# Altium schematic sheet Power1.schdoc
size 420 x 298 mm; Symbol: Sheet-Symbol_A4; Company: 嘉立创EDA; Version: V1.0; Page Size: A4; @Project Name: prj_extend_and_core_board_7_8; @Page Count: 7; @Update Date: 2024-08-09; @Create Date: 2024-08-09; @Schematic Name: Schematic1; @Page No: 1; @Page Name: Power1; Device: Sheet-Symbol_A4
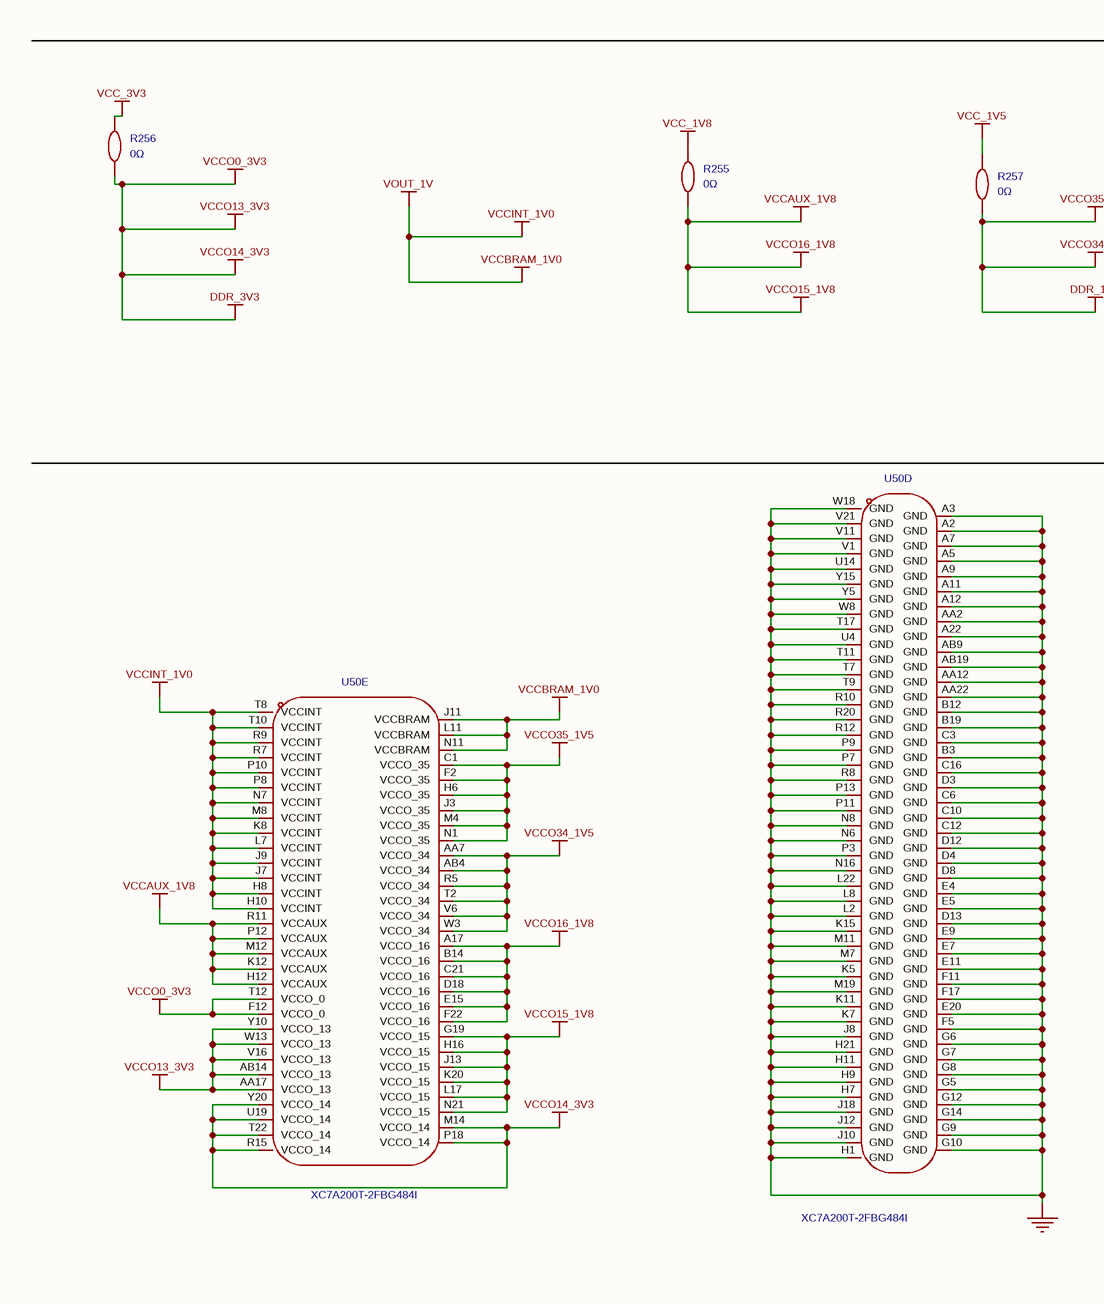
[diagram p0: Power1.schdoc, left]
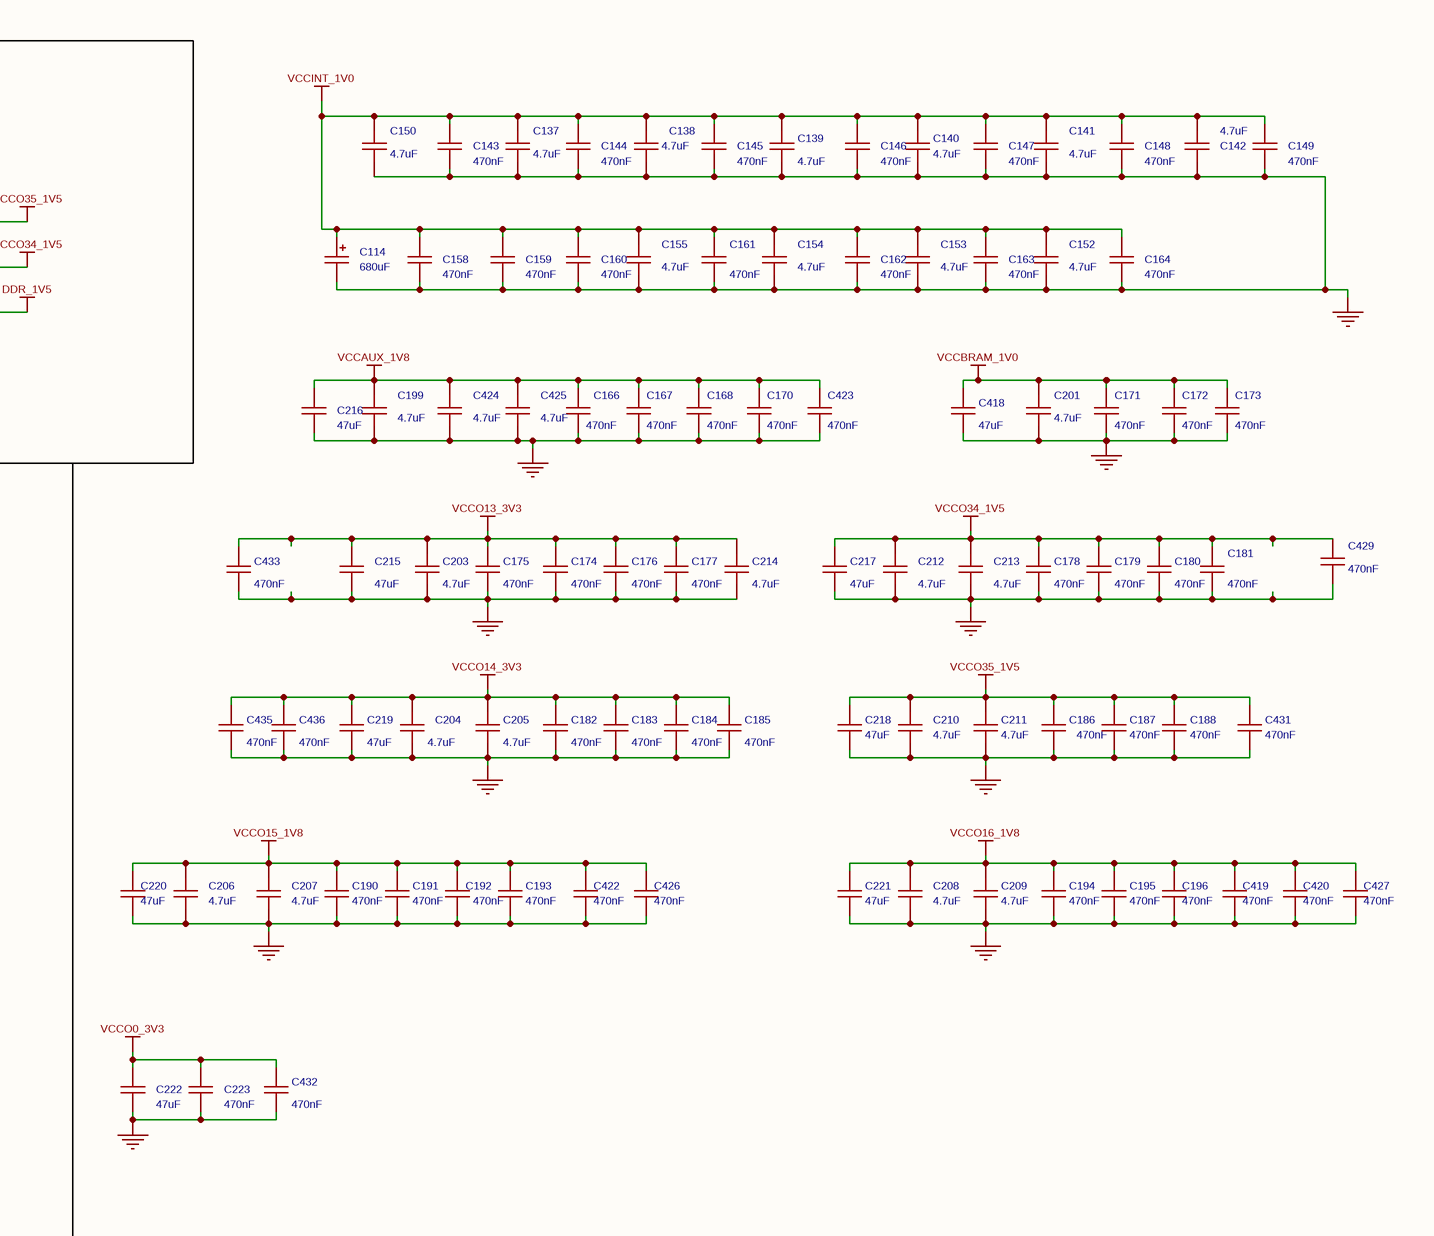
[diagram p1: Power1.schdoc, right]

## Parts
C114  680uF  [CAP-SMD_L7.3-W4.3-R-RD]
C137  4.7uF  [C0402]
C138  4.7uF  [C0402]
C139  4.7uF  [C0402]
C140  4.7uF  [C0402]
C141  4.7uF  [C0402]
C142  4.7uF  [C0402]
C143  470nF  [C0402]
C144  470nF  [C0402]
C145  470nF  [C0402]
C146  470nF  [C0402]
C147  470nF  [C0402]
C148  470nF  [C0402]
C149  470nF  [C0402]
C150  4.7uF  [C0402]
C152  4.7uF  [C0402]
C153  4.7uF  [C0402]
C154  4.7uF  [C0402]
C155  4.7uF  [C0402]
C158  470nF  [C0402]
C159  470nF  [C0402]
C160  470nF  [C0402]
C161  470nF  [C0402]
C162  470nF  [C0402]
C163  470nF  [C0402]
C164  470nF  [C0402]
C166  470nF  [C0402]
C167  470nF  [C0402]
C168  470nF  [C0402]
C170  470nF  [C0402]
C171  470nF  [C0402]
C172  470nF  [C0402]
C173  470nF  [C0402]
C174  470nF  [C0402]
C175  470nF  [C0402]
C176  470nF  [C0402]
C177  470nF  [C0402]
C178  470nF  [C0402]
C179  470nF  [C0402]
C180  470nF  [C0402]
C181  470nF  [C0402]
C182  470nF  [C0402]
C183  470nF  [C0402]
C184  470nF  [C0402]
C185  470nF  [C0402]
C186  470nF  [C0402]
C187  470nF  [C0402]
C188  470nF  [C0402]
C190  470nF  [C0402]
C191  470nF  [C0402]
C192  470nF  [C0402]
C193  470nF  [C0402]
C194  470nF  [C0402]
C195  470nF  [C0402]
C196  470nF  [C0402]
C199  4.7uF  [C0402]
C201  4.7uF  [C0402]
C203  4.7uF  [C0402]
C204  4.7uF  [C0402]
C205  4.7uF  [C0402]
C206  4.7uF  [C0402]
C207  4.7uF  [C0402]
C208  4.7uF  [C0402]
C209  4.7uF  [C0402]
C210  4.7uF  [C0402]
C211  4.7uF  [C0402]
C212  4.7uF  [C0402]
C213  4.7uF  [C0402]
C214  4.7uF  [C0402]
C215  47uF  [C0603]
C216  47uF  [C0603]
C217  47uF  [C0603]
C218  47uF  [C0603]
C219  47uF  [C0603]
C220  47uF  [C0603]
C221  47uF  [C0603]
C222  47uF  [C0603]
C223  470nF  [C0402]
C418  47uF  [C0603]
C419  470nF  [C0402]
C420  470nF  [C0402]
C422  470nF  [C0402]
C423  470nF  [C0402]
C424  4.7uF  [C0402]
C425  4.7uF  [C0402]
C426  470nF  [C0402]
C427  470nF  [C0402]
C429  470nF  [C0402]
C431  470nF  [C0402]
C432  470nF  [C0402]
C433  470nF  [C0402]
C435  470nF  [C0402]
C436  470nF  [C0402]
R255  0Ω  [R0805]
R256  0Ω  [R0805]
R257  0Ω  [R0805]
U50  XC7A200T-2FBG484I  [FBGA-484_L23.0-W23.0-R22-C22-P1.00-TL]  (parts D,E of 5)

## Nets
DDR_1V5: C178.2 C179.2 C180.2 C181.2 C186.2 C187.2 C188.2 C210.2 C211.2 C212.2 C213.2 C217.2 C218.2 C429.2 C431.2 R257.1 U50.AA7(VCCO_34) U50.AB4(VCCO_34) U50.C1(VCCO_35) U50.F2(VCCO_35) U50.H6(VCCO_35) U50.J3(VCCO_35) U50.M4(VCCO_35) U50.N1(VCCO_35) U50.R5(VCCO_34) U50.T2(VCCO_34) U50.V6(VCCO_34) U50.W3(VCCO_34)  [also labelled VCCO34_1V5, VCCO35_1V5]
DDR_3V3: C174.2 C175.2 C176.2 C177.2 C182.2 C183.2 C184.2 C185.2 C203.2 C204.2 C205.2 C214.2 C215.2 C219.2 C222.2 C223.2 C432.2 C433.2 C435.2 C436.2 R256.1 U50.AA17(VCCO_13) U50.AB14(VCCO_13) U50.F12(VCCO_0) U50.M14(VCCO_14) U50.P18(VCCO_14) U50.R15(VCCO_14) U50.T12(VCCO_0) U50.T22(VCCO_14) U50.U19(VCCO_14) U50.V16(VCCO_13) U50.W13(VCCO_13) U50.Y10(VCCO_13) U50.Y20(VCCO_14)  [also labelled VCCO0_3V3, VCCO13_3V3, VCCO14_3V3]
GND: C114.2 C137.1 C138.1 C139.1 C140.1 C141.1 C142.1 C143.1 C144.1 C145.1 C146.1 C147.1 C148.1 C149.1 C150.1 C152.1 C153.1 C154.1 C155.1 C158.1 C159.1 C160.1 C161.1 C162.1 C163.1 C164.1 C166.1 C167.1 C168.1 C170.1 C171.1 C172.1 C173.1 C174.1 C175.1 C176.1 C177.1 C178.1 C179.1 C180.1 C181.1 C182.1 C183.1 C184.1 C185.1 C186.1 C187.1 C188.1 C190.1 C191.1 C192.1 C193.1 C194.1 C195.1 C196.1 C199.1 C201.1 C203.1 C204.1 C205.1 C206.1 C207.1 C208.1 C209.1 C210.1 C211.1 C212.1 C213.1 C214.1 C215.1 C216.1 C217.1 C218.1 C219.1 C220.1 C221.1 C222.1 C223.1 C418.1 C419.1 C420.1 C422.1 C423.1 C424.1 C425.1 C426.1 C427.1 C429.1 C431.1 C432.1 C433.1 C435.1 C436.1 U50.A2(GND) U50.A3(GND) U50.A5(GND) U50.A7(GND) U50.A9(GND) U50.A11(GND) U50.A12(GND) U50.A22(GND) U50.AA2(GND) U50.AA12(GND) U50.AA22(GND) U50.AB9(GND) U50.AB19(GND) U50.B3(GND) U50.B12(GND) U50.B19(GND) U50.C3(GND) U50.C6(GND) U50.C10(GND) U50.C12(GND) U50.C16(GND) U50.D3(GND) U50.D4(GND) U50.D8(GND) U50.D12(GND) U50.D13(GND) U50.E4(GND) U50.E5(GND) U50.E7(GND) U50.E9(GND) U50.E11(GND) U50.E20(GND) U50.F5(GND) U50.F11(GND) U50.F17(GND) U50.G5(GND) U50.G6(GND) U50.G7(GND) U50.G8(GND) U50.G9(GND) U50.G10(GND) U50.G12(GND) U50.G14(GND) U50.H1(GND) U50.H7(GND) U50.H9(GND) U50.H11(GND) U50.H21(GND) U50.J8(GND) U50.J10(GND) U50.J12(GND) U50.J18(GND) U50.K5(GND) U50.K7(GND) U50.K11(GND) U50.K15(GND) U50.L2(GND) U50.L8(GND) U50.L22(GND) U50.M7(GND) U50.M11(GND) U50.M19(GND) U50.N6(GND) U50.N8(GND) U50.N16(GND) U50.P3(GND) U50.P7(GND) U50.P9(GND) U50.P11(GND) U50.P13(GND) U50.R8(GND) U50.R10(GND) U50.R12(GND) U50.R20(GND) U50.T7(GND) U50.T9(GND) U50.T11(GND) U50.T17(GND) U50.U4(GND) U50.U14(GND) U50.V1(GND) U50.V11(GND) U50.V21(GND) U50.W8(GND) U50.W18(GND) U50.Y5(GND) U50.Y15(GND)
VCC_1V5: R257.2
VCC_1V8: R255.2
VCC_3V3: R256.2
VCCAUX_1V8: C166.2 C167.2 C168.2 C170.2 C190.2 C191.2 C192.2 C193.2 C194.2 C195.2 C196.2 C199.2 C206.2 C207.2 C208.2 C209.2 C216.2 C220.2 C221.2 C419.2 C420.2 C422.2 C423.2 C424.2 C425.2 C426.2 C427.2 R255.1 U50.A17(VCCO_16) U50.B14(VCCO_16) U50.C21(VCCO_16) U50.D18(VCCO_16) U50.E15(VCCO_16) U50.F22(VCCO_16) U50.G19(VCCO_15) U50.H12(VCCAUX) U50.H16(VCCO_15) U50.J13(VCCO_15) U50.K12(VCCAUX) U50.K20(VCCO_15) U50.L17(VCCO_15) U50.M12(VCCAUX) U50.N21(VCCO_15) U50.P12(VCCAUX) U50.R11(VCCAUX)  [also labelled VCCO15_1V8, VCCO16_1V8]
VCCBRAM_1V0: C114.1 C137.2 C138.2 C139.2 C140.2 C141.2 C142.2 C143.2 C144.2 C145.2 C146.2 C147.2 C148.2 C149.2 C150.2 C152.2 C153.2 C154.2 C155.2 C158.2 C159.2 C160.2 C161.2 C162.2 C163.2 C164.2 C171.2 C172.2 C173.2 C201.2 C418.2 U50.H8(VCCINT) U50.H10(VCCINT) U50.J7(VCCINT) U50.J9(VCCINT) U50.J11(VCCBRAM) U50.K8(VCCINT) U50.L7(VCCINT) U50.L11(VCCBRAM) U50.M8(VCCINT) U50.N7(VCCINT) U50.N11(VCCBRAM) U50.P8(VCCINT) U50.P10(VCCINT) U50.R7(VCCINT) U50.R9(VCCINT) U50.T8(VCCINT) U50.T10(VCCINT)  [also labelled VCCINT_1V0, VOUT_1V]

## Notes on the sheet
- 1
- 2
- 3
- 4
- 5
- 6
- A
- B
- C
- 更新日期
- 2024-08-09
- D
- 原理图
- 图页
- Schematic1
- Power1
- 创建日期
- 物料编码
- 审阅
- 绘制
- prj_extend_and_core_board_7_8
- 版本
- V1.0
- 尺寸
- A4
- 页
- 嘉立创EDA
- 共
- 7

## Library data of the parts
C114 = 6TPE680MI: 容值:680uF;精度:±20%;额定电压:6.3V;等效串联电阻:18mΩ@100kHz;; Manufacturer: PANASONIC(松下); AddInBom: yes; ModelId: 3707aeb7c6124fd1ba335bbd8ce3cbd4; ModelName: CASE-E_L7.3-W4.3-H4.1; ModelTransform: 287.401,169.291,0,180,0,0,0,0,0; Tolerance: ±20%; Rated Voltage: 6.3V; Symbol: 6TPE680MI; Device: 6TPE680MI; Supplier: LCSC; Manufacturer Part: 6TPE680MI; Value: 680uF; Supplier Part: C79115; JLCPCB Part Class: 扩展库; LCSC Part Name: 680uF ±20% 6.3V; Supplier Footprint: CASE-D-7343; Datasheet: https://atta.szlcsc.com/upload/public/pdf/source/20180301/C178383_15198943937361383951.pdf; ConvertToPcb: yes; FootprintName: CAP-SMD_L7.3-W4.3-R-RD; Equivalent Series Resistance(ESR): 18mΩ@100kHz; Operating Temperature: -55℃~+105℃
C137-C142 C150 C152-C155 C199 C201 C203-C214 C424 C425 = CL05A475MQ5NRNC: 容值:4.7uF;精度:±20%;额定电压:6.3V;材质(温度系数):X5R;; Manufacturer: SAMSUNG(三星); Symbol: CL05A475MQ5NRNC_C307423; AddInBom: yes; ModelId: 36a51122f27c49738f86b3bfa98863e0; ModelName: C0402_L1.0-W0.5-H0.5; ModelTransform: 39.37,19.685,0,0,0,0,0,0,0; Tolerance: ±20%; Voltage Rated: 6.3V; Temperature Coefficient: X5R; Device: CL05A475MQ5NRNC; LCSC Part Name: 4.7uF ±20% 6.3V; SupplierPart: C307423; ManufacturerPart: CL05A475MQ5NRNC; Supplier Footprint: 0402; JLCPCB Part Class: 扩展库; Datasheet: https://atta.szlcsc.com/upload/public/pdf/source/20181010/C307423_0E0C4E35F3A09F81C2E5C84E00499E42.pdf; Supplier: LCSC; ConvertToPcb: yes; FootprintName: C0402; Value: 4.7uF
C143-C149 C158-C164 C166-C168 C170-C188 C190-C196 C223 C419 C420 C422 C423 C426 C427 C429 C431-C433 C435 C436 = CL05A474KP5NNNC: 容值:470nF;精度:±10%;额定电压:10V;材质(温度系数):X5R;; Manufacturer: SAMSUNG(三星); AddInBom: yes; ModelId: 36a51122f27c49738f86b3bfa98863e0; ModelName: C0402_L1.0-W0.5-H0.5; ModelTransform: 39.37,19.685,0,0,0,0,0,0,0; Tolerance: ±10%; Voltage Rated: 10V; Temperature Coefficient: X5R; Symbol: CL05A474KP5NNNC; Device: CL05A474KP5NNNC; LCSC Part Name: 470nF ±10% 10V; SupplierPart: C47339; ManufacturerPart: CL05A474KP5NNNC; Supplier Footprint: 0402; JLCPCB Part Class: 扩展库; Datasheet: https://atta.szlcsc.com/upload/public/pdf/source/20160218/1457707763339.pdf; Supplier: LCSC; ConvertToPcb: yes; FootprintName: C0402; Value: 470nF
C215-C222 C418 = GRM188R60J476ME15D: 容值:47uF;精度:±20%;额定电压:6.3V;材质(温度系数):X5R;; Manufacturer: muRata(村田); AddInBom: yes; ModelId: ac125912035d415993ca9572d50418b1; ModelName: C0603_L1.6-W0.8-H0.8; ModelTransform: 62.992,31.496,0,0,0,0,0,0,0; Tolerance: ±20%; Voltage Rated: 6.3V; Temperature Coefficient: X5R; Symbol: GRM188R60J476ME15D; Device: GRM188R60J476ME15D; Supplier: LCSC; Manufacturer Part: GRM188R60J476ME15D; Value: 47uF; Supplier Part: C140782; JLCPCB Part Class: 扩展库; LCSC Part Name: 47uF ±20% 6.3V; Supplier Footprint: 0603; Datasheet: https://atta.szlcsc.com/upload/public/pdf/source/20171113/C140782_15105612981581115778.pdf; ConvertToPcb: yes; FootprintName: C0603
R255-R257 = 0805W8F0000T5E: 电阻类型:厚膜电阻;阻值:0Ω;精度:±1%;功率:125mW;最大工作电压:150V;温度系数:±800ppm/℃;; Manufacturer: UNI-ROYAL(厚声); AddInBom: yes; ModelId: 37a81e68749a4138bd2dfa6897b24b85; ModelName: R0805_L2.0-W1.3-H0.6; ModelTransform: 78.74,51.181,0,0,0,0,0,-0.0005,0; Tolerance: ±1%; Power(Watts): 125mW; Overload Voltage (Max): 150V; Symbol: 0805W8F0000T5E; Device: 0805W8F0000T5E; Supplier: LCSC; Manufacturer Part: 0805W8F0000T5E; Supplier Part: C17477; Value: 0Ω; JLCPCB Part Class: 基础库; LCSC Part Name: 0Ω ±1% 125mW 厚膜电阻; Supplier Footprint: 0805; Datasheet: https://atta.szlcsc.com/upload/public/pdf/source/20200306/C422600_1E6D84923E4A46A82E41ADD87F860B5C.pdf; ConvertToPcb: yes; FootprintName: R0805; Type: 厚膜电阻; Temperature Coefficient: ±800ppm/℃; Operating Temperature Range: -55℃~+155℃
U50 = XC7A200T-2FBG484I: Manufacturer: AMD/XILINX(赛灵思); AddInBom: yes; ModelId: 3abebaa3ee4f462aa6190f543be940e9; ModelTransform: 905.51,905.51,0,0,0,0,0,0,0; JLCPCB Part Class: Extended Part; Symbol: XC7A200T-2FBG484I; Device: XC7A200T-2FBG484I; LCSC Part Name: XC7A200T-2FBG484I -; SupplierPart: C494680; ManufacturerPart: XC7A200T-2FBG484I; Supplier Footprint: FCBGA-484; Datasheet: https://atta.szlcsc.com/upload/public/pdf/source/20200309/C494680_F336422EF4F4583D8575B40FC985FE3D.pdf; Supplier: LCSC; ConvertToPcb: yes; FootprintName: FBGA-484_L23.0-W23.0-R22-C22-P1.00-TL; ModelName: FBGA-484_L23.0-W23.0-R22-C22-P1.00-TL